# EAGLE design brain (EAGLE 9.6.1)
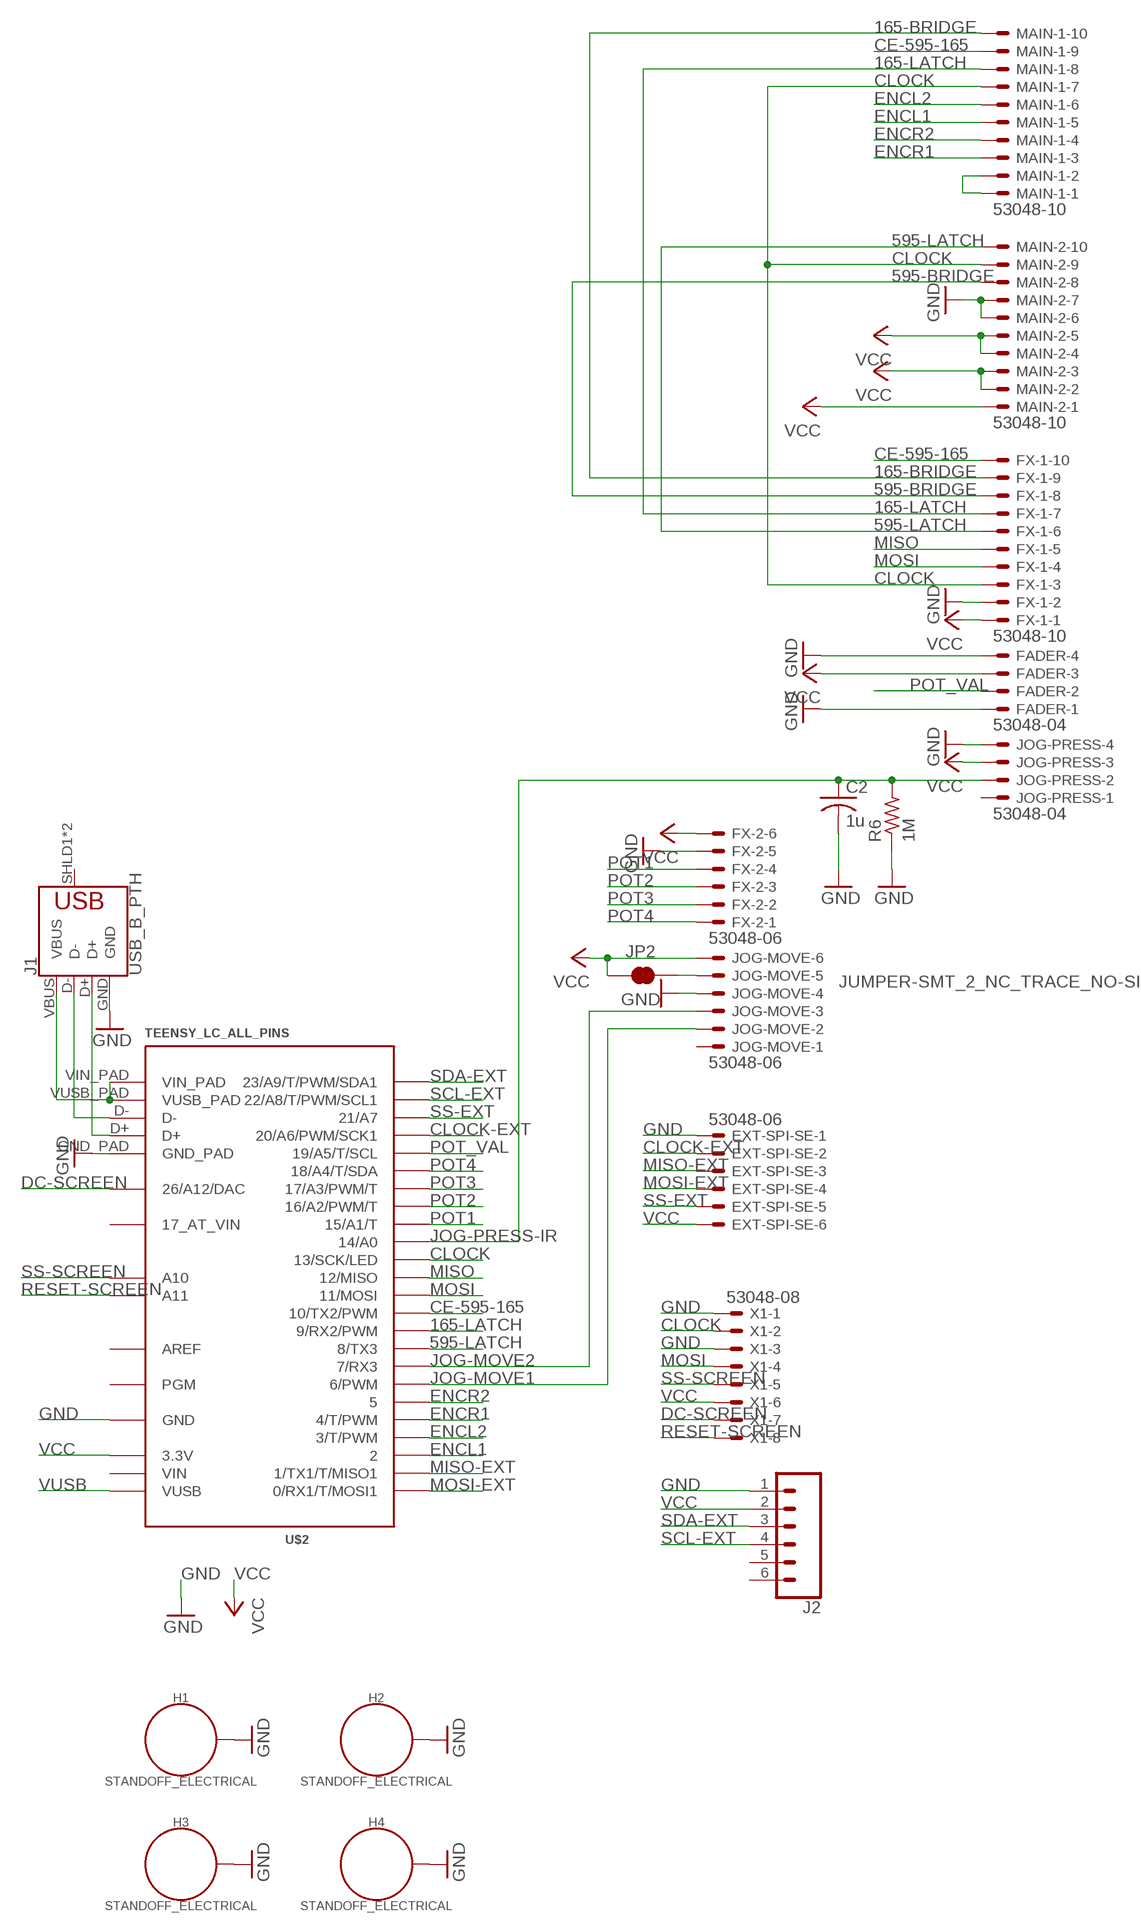
[diagram p0: schematic, sheet 1]

## Parts
C2  1u  C-USC1206  [C1206]
EXT-SPI-SE  53048-06  [53048-06]
FADER  53048-04  [53048-04]
FX-1  53048-10  [53048-10]
FX-2  53048-06  [53048-06]
H1  STANDOFF_ELECTRICAL  [STANDOFF-ELECTRICAL]
H2  STANDOFF_ELECTRICAL  [STANDOFF-ELECTRICAL]
H3  STANDOFF_ELECTRICAL  [STANDOFF-ELECTRICAL]
H4  STANDOFF_ELECTRICAL  [STANDOFF-ELECTRICAL]
J1  USB_B_PTH  [USB-B-PTH]
J2  CONN_06SILK_FEMALE_PTH  [1X06]
JOG-MOVE  53048-06  [53048-06]
JOG-PRESS  53048-04  [53048-04]
JP2  JUMPER-SMT_2_NC_TRACE_NO-SILK  [SMT-JUMPER_2_NC_TRACE_NO-SILK]
MAIN-1  53048-10  [53048-10]
MAIN-2  53048-10  [53048-10]
R6  1M  R-US_R1206  [R1206]
U$2  TEENSY_LC_ALL_PINS  [TEENSY_3.0-3.2&LC_ALL_PINS]
X1  53048-08  [53048-08]

## Nets
165-BRIDGE: FX-1.9 MAIN-1.10
165-LATCH: FX-1.7 MAIN-1.8 U$2.9(9/RX2/PWM)
595-BRIDGE: FX-1.8 MAIN-2.8
595-LATCH: FX-1.6 MAIN-2.10 U$2.8(8/TX3)
CE-595-165: FX-1.10 MAIN-1.9 U$2.10(10/TX2/PWM)
CLOCK: FX-1.3 MAIN-1.7 MAIN-2.9 U$2.13(13/SCK/LED) X1.2
CLOCK-EXT: EXT-SPI-SE.2 U$2.20/A6(20/A6/PWM/SCK1)
DC-SCREEN: U$2.RESET/DAC(26/A12/DAC) X1.7
ENCL1: MAIN-1.5 U$2.2
ENCL2: MAIN-1.6 U$2.3(3/T/PWM)
ENCR1: MAIN-1.3 U$2.4(4/T/PWM)
ENCR2: MAIN-1.4 U$2.5
GND: C2.2 EXT-SPI-SE.1 FADER.1 FADER.4 FX-1.2 FX-2.5 H1.P1 H2.P1 H3.P1 H4.P1 J1.GND J2.1 JOG-MOVE.4 JOG-PRESS.4 MAIN-2.6 MAIN-2.7 R6.1 U$2.AGND(GND) U$2.GND U$2.GND1(GND) U$2.GND_PAD X1.1 X1.3
JOG-MOVE1: JOG-MOVE.2 U$2.6(6/PWM)
JOG-MOVE2: JOG-MOVE.3 U$2.7(7/RX3)
JOG-PRESS-IR: C2.1 JOG-PRESS.2 R6.2 U$2.14/A0
MISO: FX-1.5 U$2.12(12/MISO)
MISO-EXT: EXT-SPI-SE.3 U$2.1(1/TX1/T/MISO1)
MOSI: FX-1.4 U$2.11(11/MOSI) X1.4
MOSI-EXT: EXT-SPI-SE.4 U$2.0(0/RX1/T/MOSI1)
N$1: JOG-MOVE.5 JP2.2
N$2: MAIN-1.1 MAIN-1.2
N$4: J1.VBUS U$2.VIN_PAD U$2.VUSB_PAD
N$5: J1.D- U$2.D-
N$6: J1.D+ U$2.D+
POT1: FX-2.4 U$2.15/A1(15/A1/T)
POT2: FX-2.3 U$2.16/A2(16/A2/PWM/T)
POT3: FX-2.2 U$2.17/A3(17/A3/PWM/T)
POT4: FX-2.1 U$2.18/A4(18/A4/T/SDA)
POT_VAL: FADER.2 U$2.19/A5(19/A5/T/SCL)
RESET-SCREEN: U$2.A11 X1.8
SCL-EXT: J2.4 U$2.22/A8(22/A8/T/PWM/SCL1)
SDA-EXT: J2.3 U$2.23/A9(23/A9/T/PWM/SDA1)
SS-EXT: EXT-SPI-SE.5 U$2.21/A7
SS-SCREEN: U$2.A10 X1.5
VCC: EXT-SPI-SE.6 FADER.3 FX-1.1 FX-2.6 J2.2 JOG-MOVE.6 JOG-PRESS.3 JP2.1 MAIN-2.1 MAIN-2.2 MAIN-2.3 MAIN-2.4 MAIN-2.5 U$2.3.3V U$2.3.3V1(3.3V) X1.6
VUSB: U$2.VUSB
Unconnected: J1.SHLD1(SHIELD) J1.SHLD2(SHIELD) J2.5 J2.6 JOG-MOVE.1 JOG-PRESS.1 U$2.PGM U$2.VBAT(17_AT_VIN)

## Power pins joined to a net without a drawn wire
AREF: U$2.AREF
VIN: U$2.VIN

## Library data of the parts
C2 = adafruit:C-US: CAPACITOR, American symbol
EXT-SPI-SE FX-2 JOG-MOVE = con-molex:53?-06: CONNECTOR wire to board 1.25 mm (.049 inch) pitch header; MF: WALDOM/MOLEX; MPN: 53048-0610; OC_FARNELL: 1012260; OC_NEWARK: 38C9911
FADER JOG-PRESS = con-molex:53?-04: CONNECTOR wire to board 1.25 mm (.049 inch) pitch header; MF: MOLEX; MPN: 53048-0410; OC_FARNELL: 1462887; OC_NEWARK: 57H4721
FX-1 MAIN-1 MAIN-2 = con-molex:53?-10: CONNECTOR wire to board 1.25 mm (.049 inch) pitch header; MF: MOLEX; MPN: 53048-1010; OC_FARNELL: 9733108; OC_NEWARK: 98K9838
H1-H4 = SparkFun-Hardware:STANDOFF_ELECTRICAL: Stand Off Drill holes with an electrical connection. For example, use these to ground your board to a chassis. Example SparkFun Products Screw - Phillips Head (1/4", 4-40, 10 pack) <https://www.sparkfun.com/products/10453> (PRT-10453) Screw - Phillips Head (1/2", 4-40, 10 pack) <https://www.sparkfun.com/products/10452> (PRT-10452) Screw - Phillips Head (3/4", 4-40, 10 pack) <https://www.sparkfun.com/products/10451> (PRT-10451) Screw - Phillips Head (1", 4-40, 10 pack) <https://www.sparkfun.com/products/10450> (PRT-10450)
J1 = SparkFun-Connectors:USB_B: USB Type B Connector SparkFun Products: SparkFun Stepoko <https://www.sparkfun.com/products/13899> PTH; PROD_ID: CONN-08278; SF_ID: PRT-00139
J2 = SparkFun-Connectors:CONN_06: Multi connection point. Often used as Generic Header-pin footprint for 0.1 inch spaced/style header connections On any of the 0.1 inch spaced packages, you can populate with these: Break Away Headers - Straight <https://www.sparkfun.com/products/116> (PRT-00116) Break Away Male Headers - Right Angle <https://www.sparkfun.com/products/553> (PRT-00553) Female Headers <https://www.sparkfun.com/products/115> (PRT-00115) Break Away Headers - Machine Pin <https://www.sparkfun.com/products/117> (PRT-00117) Break Away Female Headers - Swiss Machine Pin <https://www.sparkfun.com/products/743> (PRT-00743) Arduino Stackable Header - 6 Pin <https://www.sparkfun.com/products/9280> (PRT-09280) For SCREWTERMINALS and SPRING TERMINALS visit here: Screw Terimnals on SparkFun.com <https://www.sparkfun.com/search/results?term=Screw+Terminals> (5mm/3.5mm/2.54mm spacing) This device is also useful as a general connection point to wire up your design to another part of your project. Our various solder wires solder well into these plated through hole pads. Hook-Up Wire - Assortment (Stranded, 22 AWG) <https://www.sparkfun.com/products/11375> (PRT-11375) Hook-Up Wire - Assortment (Solid Core, 22 AWG) <https://www.sparkfun.com/products/11367> (PRT-11367) View the entire wire category on our website here <https://www.sparkfun.com/categories/141>; PROD_ID: CONN-08437
JP2 = SparkFun-Jumpers:JUMPER-SMT_2_NC_TRACE: Normally closed trace jumper This jumper has a trace between two pads so it's normally closed (NC). Use a razor knife to open the connection. For best results follow the IPC guidelines for cutting traces: Cutout at least 0.063 mm (0.005 in). Remove all loose material to clean up the cut area. Seal the cut with an approved epoxy. Reapply solder to reclose the connection.
R6 = adafruit:R-US_: RESISTOR, American symbol
U$2 = Teensy_3_and_LC_Series_Boards_v1.4:TEENSY_LC_ALL_PINS: Teensy LC board with all pins used.
X1 = con-molex:53?-08: CONNECTOR wire to board 1.25 mm (.049 inch) pitch header; MF: WALDOM/MOLEX; MPN: 53048-0810; OC_FARNELL: 9733094; OC_NEWARK: 38C9913

## Net classes
0 default: width 0.015 mm

## Board
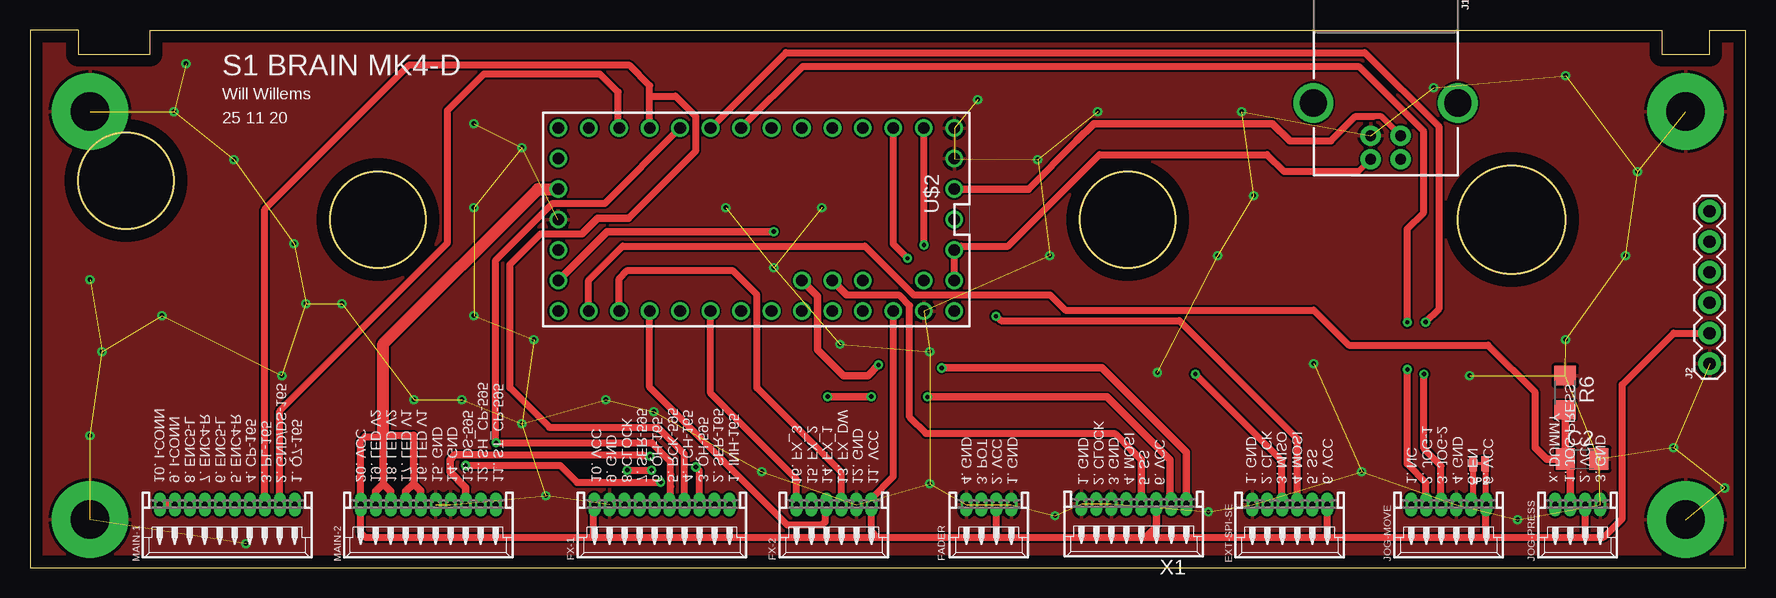
[diagram p1: board, top side]
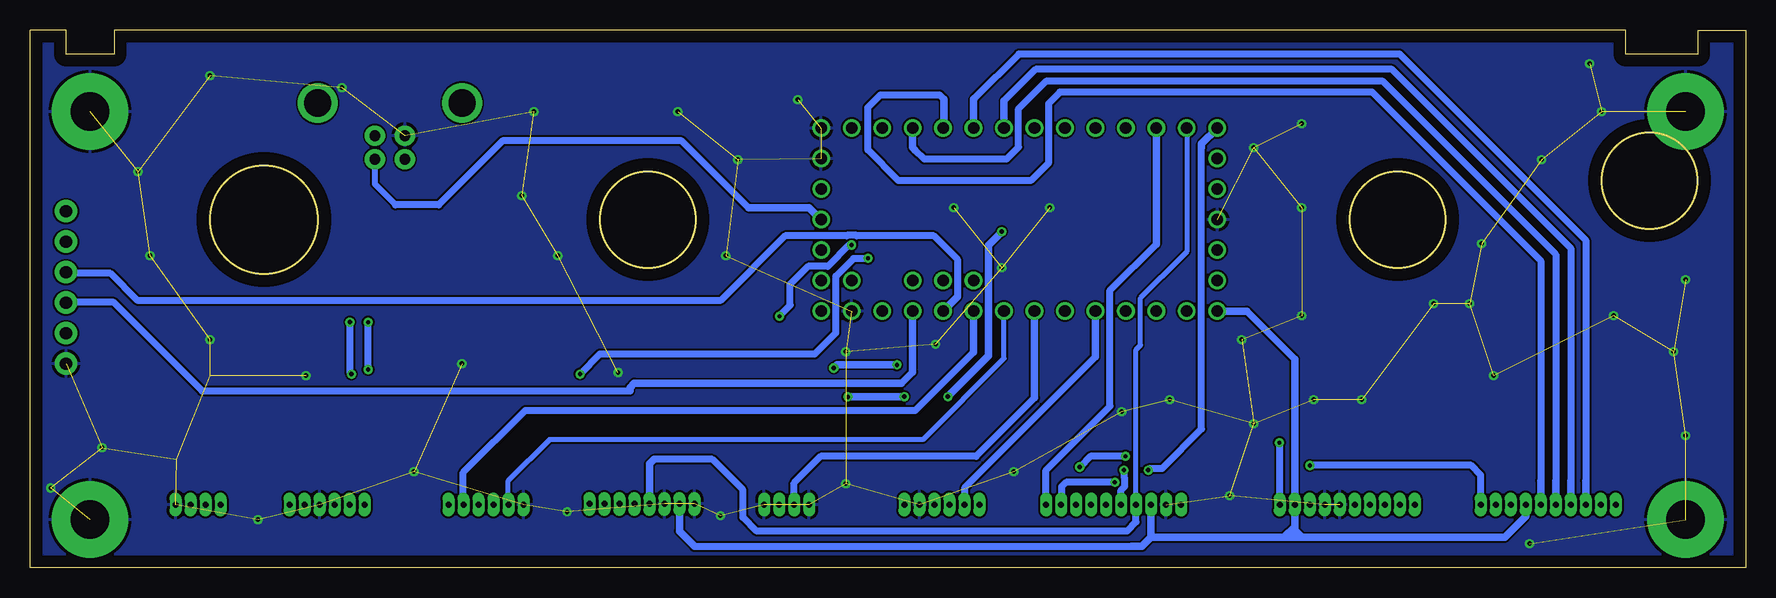
[diagram p2: board, bottom side, seen from below]

Size 143 x 44.8 mm. Coordinates in mm from the lower left corner, seen from the top.
Outline: 0,0 143,0 143,44.8 140,44.8 140,42.8 136,42.8 136,44.8 10,44.8 10,42.8 4,42.8 4,44.8 0,44.8 0,0
Outline: circle at 123.5,29 radius 4.5
Outline: circle at 91.5,29 radius 4
Outline: circle at 29,29 radius 4
Outline: circle at 8,32.25 radius 4
Copper layers (1*16): Top 0.035mm / dielectric 1.5mm / Bottom 0.035mm
Design rules "default": minimum track width 6mil, minimum drill 0.35mm, track to track 6mil, track to pad 6mil, pad to pad 6mil, via to via 6mil, smd to smd 6mil, copper to edge 40mil, drill to drill 6mil, minimum pad ring 10mil, minimum via ring 8mil, stop-mask expansion 4mil, vias tented up to drill 0mil, thermal gap 10mil

### Footprints (pad centres in the part's own frame; a part is rotated, then mirrored left to right if it is on the bottom)
C1206 = smd 1.6 x 1.8: 1 -1.4,0; 2 1.4,0
53048-06 = drill 0.5 pad 0.698 long: 1 3.125,-1.25; 2 1.875,-1.25; 3 0.625,-1.25; 4 -0.625,-1.25; 5 -1.875,-1.25; 6 -3.125,-1.25
53048-04 = drill 0.5 pad 0.698 long: 1 1.875,-1.25; 2 0.625,-1.25; 3 -0.625,-1.25; 4 -1.875,-1.25
53048-10 = drill 0.5 pad 0.698 long: 1 5.625,-1.25; 2 4.375,-1.25; 3 3.125,-1.25; 4 1.875,-1.25; 5 0.625,-1.25; 6 -0.625,-1.25; 7 -1.875,-1.25; 8 -3.125,-1.25; 9 -4.375,-1.25; 10 -5.625,-1.25
STANDOFF-ELECTRICAL = drill 3.2 pad 6.35: P1 0,0
USB-B-PTH = drill 0.914 pad 1.676: D+ 4,1.25; D- 5.981,1.25; GND 4,-1.25; VBUS 5.981,-1.25 | drill 2.286: SHLD1 1.282,-6.02; SHLD2 1.282,6.02
1X06 = drill 1.016 pad 1.88: 1 0,0; 2 2.54,0; 3 5.08,0; 4 7.62,0; 5 10.16,0; 6 12.7,0
SMT-JUMPER_2_NC_TRACE_NO-SILK = smd 0.635 x 1.27: 1 -0.508,0; 2 0.508,0
R1206 = smd 1.6 x 1.803: 1 -1.422,0; 2 1.422,0
TEENSY_3.0-3.2&LC_ALL_PINS = drill 0.965: 0 -7.62,13.97; 1 -7.62,11.43; 2 -7.62,8.89; 3 -7.62,6.35; 3.3V 7.62,11.43; 3.3V1 -2.54,-16.51; 4 -7.62,3.81; 5 -7.62,1.27; 6 -7.62,-1.27; 7 -7.62,-3.81; 8 -7.62,-6.35; 9 -7.62,-8.89; 10 -7.62,-11.43; 11 -7.62,-13.97; 12 -7.62,-16.51; 13 7.62,-16.51; 14/A0 7.62,-13.97; 15/A1 7.62,-11.43; 16/A2 7.62,-8.89; 17/A3 7.62,-6.35; 18/A4 7.62,-3.81; 19/A5 7.62,-1.27; 20/A6 7.62,1.27; 21/A7 7.62,3.81; 22/A8 7.62,6.35; 23/A9 7.62,8.89; A10 5.08,6.35; A11 5.08,3.81; AGND 7.62,13.97; AREF 5.08,8.89; D+ -2.54,16.51; D- 0,16.51; GND -7.62,16.51; GND1 0,-16.51; GND_PAD -5.08,16.51; PGM 2.54,-16.51; RESET/DAC 5.08,-16.51; VBAT -5.08,-16.51; VIN 7.62,16.51; VIN_PAD 5.08,16.51; VUSB 5.08,13.97; VUSB_PAD 2.54,16.51
53048-08 = drill 0.5 pad 0.698 long: 1 4.375,-1.25; 2 3.125,-1.25; 3 1.875,-1.25; 4 0.625,-1.25; 5 -0.625,-1.25; 6 -1.875,-1.25; 7 -3.125,-1.25; 8 -4.375,-1.25

### Placement (x,y rotation side)
C2  129.38,9.05 0 top
EXT-SPI-SE  105,4 180 top
FADER  79.93,4 180 top
FX-1  52.68,4 180 top
FX-2  67,4 180 top
H1  5,4 0 top
H2  138,4 0 top
H3  5,38 0 top
H4  138,38 0 top
J1  113,40 270 top
J2  140,17 90 top
JOG-MOVE  118.25,4 180 top
JOG-PRESS  129,4 180 top
JP2  120.79,8.65 180 top
MAIN-1  16.44,4 180 top
MAIN-2  33.2,4 180 top
R6  127.97,14.58 270 top
U$2  60.54,29 270 top
X1  92,4.06 180 top

### Tracks (layer width: path | path; a pad name or v marks a point on that pad's centre or on a via)
165-BRIDGE  (via drill 0.35 pad 0.76)
  Top 0.6: v52.58,7.11 45.59,7.11 44.2,8.51 v36.32,8.51
  Bottom 0.152: MAIN-1.10 22.1,5.33 22.07,5.33 | 56.99,5.33 57,5.33 FX-1.9
  Bottom 0.6: v52.58,7.11 56.64,7.11 56.99,6.76 56.99,5.33 56.99,5.31 FX-1.9 | v36.32,8.51 22.86,8.51 22.07,7.71 22.07,5.33 MAIN-1.10
165-LATCH
  Top 0.152: MAIN-1.8 19.66,5.33 19.57,5.33 | 51.65,36.73 51.66,36.73 U$2.9 | FX-1.7 54.56,5.33 54.55,5.33
  Top 0.6: FX-1.7 54.55,5.33 54.55,9.45 52.32,11.68 43.31,11.68 40.01,14.99 40.01,25.27 42.54,27.81 46,27.81 | 49.88,29.12 55.51,34.74 55.51,37.59 53.81,39.28 51.65,39.28 | 51.65,39.28 51.65,40.17 49.92,41.9 31.61,41.9 19.57,29.85 19.57,5.33 MAIN-1.8 | U$2.9 51.65,36.73 51.65,39.28
  Top 0.61: 46,27.81 47.31,29.12 49.88,29.12
595-BRIDGE  (via drill 0.35 pad 0.76)
  Top 0.152: FX-1.8 55.78,5.33 55.8,5.33
  Top 0.6: v51.69,9.27 51.66,9.3 51.15,9.3 51.04,9.41 37.45,9.41 | FX-1.8 55.8,5.33 55.8,8.03 55.5,8.34 v55.5,8.38
  Top 0.61: MAIN-2.8 36.33,6.67 35,8 35,9 35.41,9.41 37.45,9.41
  Bottom 0.6: v51.69,9.27 54.61,9.27 v55.5,8.38
595-LATCH  (via drill 0.35 pad 0.76)
  Top 0.152: 53.37,5.31 53.34,5.33 FX-1.6 | 54.12,36.55 54.1,36.58 U$2.8 | 53.38,6.55 53.49,6.55 53.41,6.77
  Top 0.6: FX-1.6 53.37,5.31 53.38,5.33 53.38,6.55 53.38,6.74 53.41,6.77 53.41,7.74 53.41,8.82 51.82,10.41 v38.86,10.41 38.83,10.41 38.83,25.62 43.56,30.35 47.92,30.35 54.12,36.55 U$2.8
  Bottom 0.152: MAIN-2.10 38.86,5.33 38.83,5.33
  Bottom 0.6: v38.86,10.41 38.83,10.38 38.83,5.33 MAIN-2.10
CE-595-165
  Top 0.152: MAIN-1.9 20.88,5.33 20.82,5.33 | 49.02,36.73 49.07,36.73 U$2.10
  Top 0.6: MAIN-1.9 20.82,5.33 20.82,13.07 34.8,27.05 34.8,38.1 37.85,41.15 47.5,41.15 49.02,39.62 49.02,36.73 49.02,36.71 U$2.10
  Bottom 0.152: FX-1.10 58.37,5.33 58.3,5.33
  Bottom 0.6: 49.11,26.96 52.96,23.11 52.96,13.46 58.3,8.12 58.3,5.33 FX-1.10
  Bottom 0.61: U$2.10 49.11,26.96 | 49.11,26.96
CLOCK
  Bottom 0.152: 18.29,5.33 MAIN-1.7 18.29,5.33
  Bottom 0.6: 18.32,4.29 MAIN-1.7 | 87.62,1.78 51.19,1.78 | 37.58,17.38 41.57,21.38
  Bottom 0.61: FX-1.3 | FX-1.3 49.55,2.52 | U$2.13 | U$2.13 41.57,21.38 | 37.58,3.42 MAIN-2.9 37.58,17.38 | 49.55,2.52 38.48,2.52 | 37.58,3.42 38.48,2.52 | 38.48,2.52 37,2.52 | 37.58,17.38 | 37.58,3.42 37.58,3.1 37,2.52 | X1.2 88.88,3.03 87.62,1.78 | 18.32,4.29 20.08,2.52 37,2.52 | 51.19,1.78 50.3,1.78 49.55,2.52
CLOCK-EXT
  Bottom 0.152: EXT-SPI-SE.2 103.17,5.33 103.12,5.33
  Bottom 0.4: EXT-SPI-SE.2 103.12,5.33 103.12,7.24 99.69,10.67 68.58,10.67 61.81,17.44
  Bottom 0.406: 61.81,17.44 U$2.20/A6 | U$2.20/A6
DC-SCREEN  (via drill 0.35)
  Top 0.61: X1.7 95,5.44 95,9 89.78,14.22 v74.8,14.22 | U$2.RESET/DAC 48.11,28 v62,28 | v70.13,14.25 v66.49,14.25
  Bottom 0.61: v62,28 63.12,26.88 63.12,17.65 66.49,14.28 v66.49,14.25 | v70.13,14.25 74.77,14.25 v74.8,14.22
ENCL1
  Bottom 0.6: 69.4,34.98 69.21,34.79 68.45,34.04 61.59,34.04 60.59,35.05 60.59,38.25 58.33,40.51 30.23,40.51 15.81,26.1 15.81,7.25
  Bottom 0.61: 15.81,7.25 MAIN-1.5 | MAIN-1.5 | 69.21,34.79 69.43,35.01 U$2.2
ENCL2
  Bottom 0.6: 66.8,39.02 67.15,39.37 72.14,39.37 73.16,38.35 73.16,34.8 70.61,32.26 59.58,32.26 58.08,33.75 58.08,38.69 57.15,39.62 31.11,39.62 17.07,25.57 17.07,7.25
  Bottom 0.61: 17.07,7.25 MAIN-1.6 | MAIN-1.6 | 66.8,39.02 66.8,36.71 U$2.3
ENCR1
  Bottom 0.6: 64.26,39.12 60.58,42.8 28.83,42.8 13.31,27.29 13.31,7.25
  Bottom 0.61: 13.31,7.25 MAIN-1.3 | MAIN-1.3 | 64.26,39.12 64.35,39.03 U$2.4
ENCR2
  Bottom 0.6: 14.56,7.25 14.56,26.63 29.46,41.53 59.18,41.53 61.81,38.9
  Bottom 0.61: 14.56,7.25 MAIN-1.4 | MAIN-1.4 | 61.81,38.9 | 61.81,38.9 U$2.5
GND  (via drill 0.35)  (73 unrouted)
  other vias: 5,24 11,21 6,18 5,11 22,27 21,16 26,22 23,22 17,34 12,38 13,42 37,37 37,30 41,35 37,21 32,14 36,14 41,12 42,19 48,14 43,6 61,8 75,7 67.51,18.62 75,18 62,25 58,30 66,30 79,39 89,38 84,34 85,26 99,26 102,31 101,38 117,40 128,41 134,33 133,26 128,19 120,16 107,17 111,8 124,4 137,10 93.98,16.26 85.45,4.32 98.24,4.64 18,2 52,13 141.25,6.63
  pour Bottom: -1,-1 -1,46 144,46 144,-1
  pour Top: -1,-1 144,-1 144,46 -1,46
JOG-MOVE1  (via drill 0.35 pad 0.76)
  Top 0.152: JOG-MOVE.2 116.43,5.33 116.38,5.33 | 59.33,36.68 59.28,36.73 U$2.6
  Top 0.6: JOG-MOVE.2 116.38,5.33 116.38,7.07 114.81,8.64 v114.81,16.51 | v114.81,20.45 114.81,28.22 116.18,29.59 116.18,36.35 110.76,41.77 64.42,41.77 59.33,36.68 U$2.6
  Bottom 0.6: v114.81,16.51 v114.81,20.45
JOG-MOVE2  (via drill 0.35 pad 0.76)
  Top 0.152: JOG-MOVE.3 117.65,5.33 117.62,5.33 | 56.84,36.73 U$2.7
  Top 0.6: U$2.7 56.84,36.73 63.02,42.91 111.27,42.91 117.46,36.72 117.46,21.59 v116.33,20.46 | JOG-MOVE.3 117.62,5.33 117.62,8.49 116.2,9.91 v116.2,16.13
  Bottom 0.6: v116.2,16.13 116.33,16.26 v116.33,20.46
JOG-PRESS-IR
  Top 0.152: 46.57,21.49 46.63,21.49 U$2.14/A0
  Top 0.6: 125.48,10 125.48,14.61 121.54,18.54 109.92,18.54 107,21.46 86.3,21.46 85.03,22.73 73.66,22.73 69.6,26.8 49.4,26.8 46.57,23.96 46.57,21.49 U$2.14/A0
  Top 0.61: C2.1 128.38,8.65 JOG-PRESS.2 | C2.1 126.43,9.05 125.48,10 | R6.2 127.98,13.15 C2.1
MISO  (via drill 0.35 pad 0.76)
  Top 0.6: v49.78,8.13 v51.82,8.13
  Bottom 0.152: FX-1.5 52.12,5.33 52.05,5.33
  Bottom 0.6: FX-1.5 52.05,5.33 52.05,6.46 51.75,6.77 51.75,7.46 51.79,7.5 51.79,8.1 v51.82,8.13 51.82,8.09 | v49.78,8.13 49.66,8.26 48.64,8.26 45.34,11.56 45.34,35 45.34,35.31
  Bottom 0.61: 45.34,35 45.34,35.31 U$2.12
MISO-EXT  (via drill 0.35 pad 0.76)
  Top 0.152: EXT-SPI-SE.3 104.39,5.33 104.38,5.33 | 71.97,36.58 72.08,36.58 U$2.1
  Top 0.6: EXT-SPI-SE.3 104.38,5.33 104.38,8.91 v97.16,16.13 | v73.15,25.78 71.97,26.96 71.97,36.58 U$2.1
  Bottom 0.6: v97.16,16.13 95.5,17.78 77.6,17.78 75.82,19.56 75.82,24.29 74.36,25.75 73.18,25.75 v73.15,25.78
MOSI
  Bottom 0.152: FX-1.4 50.9,5.33 50.8,5.1 | FX-1.4 50.9,5.18 FX-1.4
  Bottom 0.4: FX-1.4 50.8,18.16 50.42,18.54 50.42,22.48 46.95,25.95 46.57,26.33
  Bottom 0.406: U$2.11 46.57,26.33 46.95,25.95
  Bottom 0.6: 50.73,5.17 50.8,5.1 50.8,3.81 51.56,3.05 82.42,3.05 83.57,4.19 83.57,6.48 86.11,9.02 91,9.02
  Bottom 0.61: X1.4 91.38,8.64 91,9.02
MOSI-EXT  (via drill 0.35 pad 0.76)
  Top 0.152: EXT-SPI-SE.4 105.61,5.33 105.62,5.33 | 74.51,36.58 74.52,36.58 U$2.0
  Top 0.6: v74.51,26.89 74.51,36.58 U$2.0 74.59,36.62 | v80.52,20.95 80.56,20.95 80.94,20.57 95.81,20.57 105.62,10.76 105.62,5.33 EXT-SPI-SE.4
  Bottom 0.6: v74.51,26.89 74.72,26.89 76.49,25.11 78.14,25.11 79.63,23.62 79.63,21.87 80.52,20.98 v80.52,20.95
N$1
  Top 0.508: JP2.2 120.28,5.41 JOG-MOVE.5
N$2
  Top 0.61: MAIN-1.1 MAIN-1.2
N$4
  Top 0.152: U$2.VIN_PAD 77.11,23.93 U$2.VIN_PAD | 77.05,26.36 77.11,26.36 U$2.VUSB_PAD
  Top 0.508: J1.VBUS 110.75,33.02 110,33.02
  Top 0.6: 110,33.02 104.52,33.02 103.12,34.42 89.15,34.42 81.53,26.8 77.62,26.8 77.29,26.46 U$2.VUSB_PAD 77.05,26.36 U$2.VIN_PAD
N$5
  Bottom 0.508: 112.52,30.23 114.25,31.95 J1.D-
  Bottom 0.6: 112.52,30.23 108.93,30.23 103.61,35.55 88.67,35.55 83.12,30
  Bottom 0.61: 83.12,30 78.05,30 U$2.D-
N$6
  Top 0.508: J1.D+ 112.66,37.59 112,37.59
  Top 0.6: 105,35.55 108.45,35.55 110.49,37.59 112,37.59 | 83.21,31.54 87.22,35.55
  Top 0.61: 83.21,31.54 U$2.D+ | U$2.D+ | 87.22,35.55 88.67,37 103.55,37 105,35.55
POT1
  Top 0.152: FX-2.4 67.67,5.33 67.62,5.33 | 49.11,21.49 49.23,21.49 U$2.15/A1
  Top 0.6: FX-2.4 67.62,5.33 67.62,7.94 60.59,14.98 60.59,22.73 58.55,24.77 49.78,24.77 49.11,24.09 49.11,21.49 U$2.15/A1
POT2
  Top 0.152: FX-2.3 66.45,5.33 66.3,5.17 | 51.65,21.3 51.66,21.34 U$2.16/A2
  Top 0.6: FX-2.3 66.3,5.17 66.3,3.81 66.04,3.55 63.12,3.55 51.65,15.03 51.65,21.3 51.69,21.34 U$2.16/A2
POT3
  Bottom 0.152: FX-2.2 65.23,5.33 65.05,5.33
  Bottom 0.6: 54.19,17.57 65.05,6.71 65.05,5.33 FX-2.2
  Bottom 0.61: 54.19,17.57 U$2.17/A3 | U$2.17/A3
POT4
  Top 0.152: FX-2.1 63.86,5.33 63.88,5.33 | 56.73,21.34 56.84,21.34 U$2.18/A4
  Top 0.6: FX-2.1 63.88,5.33 63.88,7.37 56.73,14.52 56.73,21.34 U$2.18/A4
POT_VAL
  Bottom 0.152: FADER.2 79.4,5.33 79.31,5.33
  Bottom 0.6: FADER.2 79.31,5.33 79.31,7.05 77.09,9.27 64.14,9.27 59.27,14.14
  Bottom 0.61: 59.27,14.14 U$2.19/A5 | U$2.19/A5
RESET-SCREEN  (via drill 0.35)
  Top 0.61: X1.8 96.38,9.62 89.36,16.64 v76,16.64 | U$2.A11 65.66,22.61 65.66,18.16 67.82,16 69.85,16 v70.74,16.89
  Bottom 0.61: v70.74,16.89 75.74,16.89 v76,16.64
SCL-EXT
  Bottom 0.152: J2.4 140.06,24.69 139.89,24.51
  Bottom 0.6: 65.7,22.57 65.7,25.7 67.65,27.65 74.1,27.65 74.17,27.71 74.85,27.71 74.92,27.65 80.05,27.65 85.45,22.24 134.02,22.24 136.29,24.51 139.89,24.51 J2.4
  Bottom 0.61: 65.7,22.57 U$2.22/A8 | U$2.22/A8
SDA-EXT
  Bottom 0.152: J2.3 140.06,22.1 139.98,22.1
  Bottom 0.6: 70.36,15.36 69.43,16.3 | J2.3 139.98,22.1 136.02,22.1 128.65,14.73 93,14.73
  Bottom 0.61: 69.43,16.3 U$2.23/A9 | U$2.23/A9 | 93,14.73 93,15 92.64,15.36 70.36,15.36
SS-EXT
  Bottom 0.152: EXT-SPI-SE.5 106.83,5.33 106.88,5.33
  Bottom 0.6: EXT-SPI-SE.5 106.88,5.33 106.88,7.93 101.73,13.08 69.22,13.08 64.35,17.95
  Bottom 0.61: U$2.21/A7 64.35,17.95 | 64.35,17.95
SS-SCREEN
  Top 0.6: 91.8,9.8 90.42,11.18 74.68,11.18 73.32,12.53 73.32,21.84 72.43,22.73 68.08,22.73
  Top 0.61: U$2.A10 68.08,22.73 | 68.08,22.73 | X1.5 92.62,8.97 91.8,9.8
VCC
  Top 0.152: MAIN-2.1 27.57,5 | 29.57,11.12 29.45,10.91 | 46.99,5.18 47.09,5.18 FX-1.1 | 32,11.12 31.98,11.03 | FX-2.6 70.1,5.33 70.12,5.33 | 44.04,31.55 U$2.3.3V1 | U$2.3.3V1 | U$2.3.3V 72.08,21.34 71.97,21.34 | 80.62,5.33 FADER.3 80.62,5.33 | 108.2,5.33 EXT-SPI-SE.6 108.2,5.33 | 121.46,5.33 JOG-MOVE.6 121.46,5.33 | 129.69,5.33 JOG-PRESS.3 129.69,5.33 | 140.06,19.51 J2.2 140.06,19.51
  Top 0.508: JP2.1 121.3,5.33 JOG-MOVE.6
  Top 0.6: 46.99,2.54 27.93,2.54 27.57,2.89 27.57,5 27.57,10.56 27.93,10.91 29.45,10.91 | 46.99,2.54 70.61,2.54 | 70.61,2.54 80.77,2.54 | 80.77,2.54 93,2.54 108.2,2.54 | 46.99,2.54 46.99,5.18 FX-1.1 47.13,5.17 | FADER.3 80.56,2.76 80.77,2.54 | 108.2,2.54 121.38,2.54 | 121.38,2.54 129.79,2.54 | 129.79,2.54 131.19,2.54 132.72,4.06 132.72,15.24 137.01,19.54 J2.2 | 108.2,2.54 108.12,2.62 EXT-SPI-SE.6 | JOG-PRESS.3 129.62,2.71 129.79,2.54 | 29.45,10.91 29.57,11.03 31.98,11.03 | U$2.3.3V 71.97,21.34 71.97,7.6 70.12,5.75 70.12,5.33 70.12,3.03 70.61,2.54 | 29.45,10.91 29.45,11.03 | 121.38,2.54 JOG-MOVE.6 | 31.98,8.18 31.98,7 | 29.45,7.99 29.45,7
  Top 0.61: X1.6 93.88,3.42 93,2.54 | MAIN-2.4 31.32,6.35 31.98,7 32.58,6.4 MAIN-2.5 | MAIN-2.2 28.82,6.38 29.45,7 30.07,6.38 MAIN-2.3 | 29.57,11.03 29.45,10.91 29.45,7.99 | 31.98,11.03 31.98,8.18
  Top 1: U$2.3.3V1 42.34,31.54 29.45,18.65 29.45,11.03

### Text on the board
tPlace: S1 BRAIN MK4-D | Will Willems | 25 11 20 | 1. Q7-165 / 2. GND/DS-165 / 3. PL-165 / 4. CP-165 / 5. ENC4-R / 6. ENC5-L / 7. ENC4-R / 8. ENC5-L / 9. I-CONN / 10. I-CONN | 11. ST_CP-595 / 12. SH_CP-595 / 13. DS-595 / 14. GND / 15. GND / 16. LED V1 / 17. LED V1 / 18. LED V2 / 19. LED V2 / 20. VCC | 1. INH-165 / 2. SER-165 / 3. QH-595 / 4. LCH-165 / 5. RCK-595 / 6. QH-165 / 7. SER-595 / 8. CLOCK / 9. GND / 10. VCC | 11. VCC / 12. GND / 13. FX_DW / 14. FX_1 / 15. FX_2 / 16. FX_3 | 1. GND / 2. VCC / 3. POT / 4. GND | 6. VCC / 5. SS / 4. MOSI / 3. GND / 2. CLOCK / 1. GND | 6. VCC / 5. SS / 4. MOSI / 3. MISO / 2. CLCK / 1. GND | 6. VCC / 5. EN / 4. GND / 3. JOG-2 / 2. JOG-1 / 1. NC | 3. GND / 2. VCC / 1. JOG-PRESS / x. DUMMY